# EAGLE design board led (EAGLE 7.6.0)
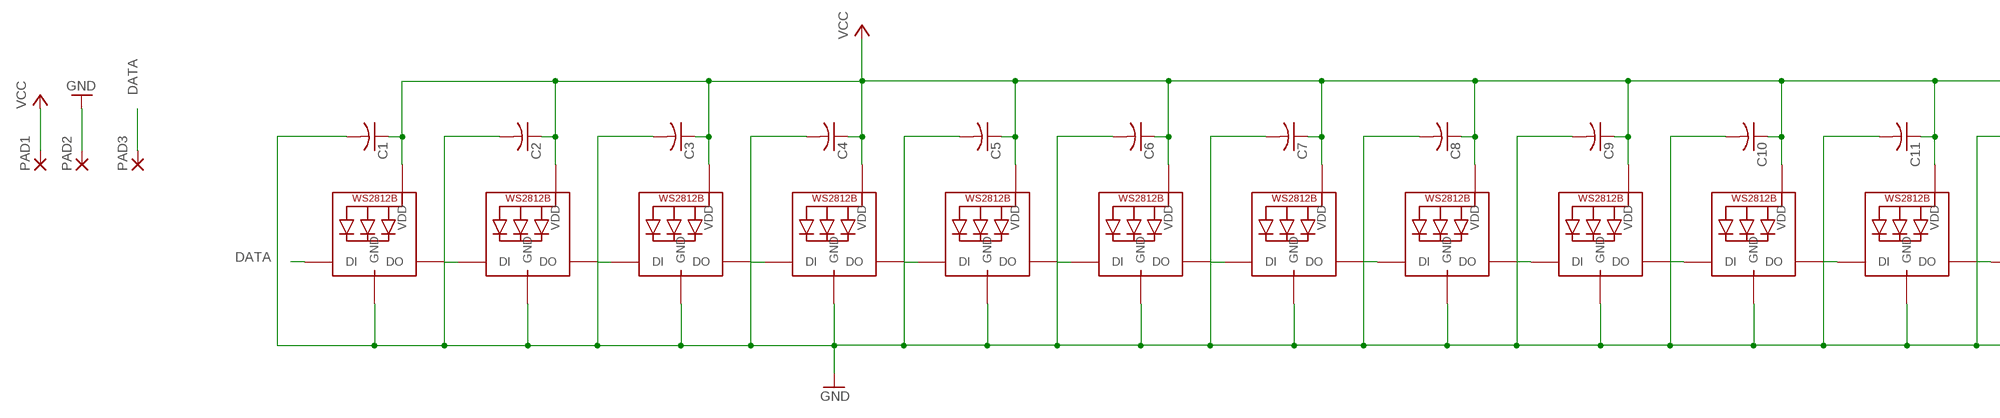
[diagram p0: schematic, sheet 1, part 1 of 2]
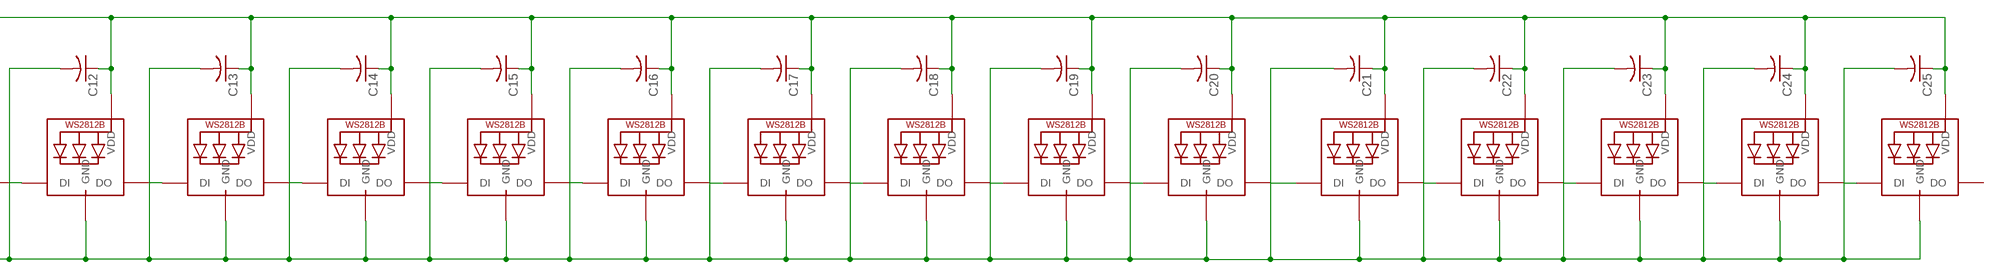
[diagram p1: schematic, sheet 1, part 2 of 2]

## Parts
C1  C-USC0805  [C0805]
C2  C-USC0805  [C0805]
C3  C-USC0805  [C0805]
C4  C-USC0805  [C0805]
C5  C-USC0805  [C0805]
C6  C-USC0805  [C0805]
C7  C-USC0805  [C0805]
C8  C-USC0805  [C0805]
C9  C-USC0805  [C0805]
C10  C-USC0805  [C0805]
C11  C-USC0805  [C0805]
C12  C-USC0805  [C0805]
C13  C-USC0805  [C0805]
C14  C-USC0805  [C0805]
C15  C-USC0805  [C0805]
C16  C-USC0805  [C0805]
C17  C-USC0805  [C0805]
C18  C-USC0805  [C0805]
C19  C-USC0805  [C0805]
C20  C-USC0805  [C0805]
C21  C-USC0805  [C0805]
C22  C-USC0805  [C0805]
C23  C-USC0805  [C0805]
C24  C-USC0805  [C0805]
C25  C-USC0805  [C0805]
LED1  WS2812B5050  [WS2812B]
LED2  WS2812B5050  [WS2812B]
LED3  WS2812B5050  [WS2812B]
LED4  WS2812B5050  [WS2812B]
LED5  WS2812B5050  [WS2812B]
LED6  WS2812B5050  [WS2812B]
LED7  WS2812B5050  [WS2812B]
LED8  WS2812B5050  [WS2812B]
LED9  WS2812B5050  [WS2812B]
LED10  WS2812B5050  [WS2812B]
LED11  WS2812B5050  [WS2812B]
LED12  WS2812B5050  [WS2812B]
LED13  WS2812B5050  [WS2812B]
LED14  WS2812B5050  [WS2812B]
LED15  WS2812B5050  [WS2812B]
LED16  WS2812B5050  [WS2812B]
LED17  WS2812B5050  [WS2812B]
LED18  WS2812B5050  [WS2812B]
LED19  WS2812B5050  [WS2812B]
LED20  WS2812B5050  [WS2812B]
LED21  WS2812B5050  [WS2812B]
LED22  WS2812B5050  [WS2812B]
LED23  WS2812B5050  [WS2812B]
LED24  WS2812B5050  [WS2812B]
LED25  WS2812B5050  [WS2812B]
PAD1  SMD5  [SMD2,54-5,08]
PAD2  SMD5  [SMD2,54-5,08]
PAD3  SMD5  [SMD2,54-5,08]

## Nets
DATA: LED1.4-DIN(DI) PAD3.1(P)
GND: C1.2 C2.2 C3.2 C4.2 C5.2 C6.2 C7.2 C8.2 C9.2 C10.2 C11.2 C12.2 C13.2 C14.2 C15.2 C16.2 C17.2 C18.2 C19.2 C20.2 C21.2 C22.2 C23.2 C24.2 C25.2 LED1.3-GND(GND) LED2.3-GND(GND) LED3.3-GND(GND) LED4.3-GND(GND) LED5.3-GND(GND) LED6.3-GND(GND) LED7.3-GND(GND) LED8.3-GND(GND) LED9.3-GND(GND) LED10.3-GND(GND) LED11.3-GND(GND) LED12.3-GND(GND) LED13.3-GND(GND) LED14.3-GND(GND) LED15.3-GND(GND) LED16.3-GND(GND) LED17.3-GND(GND) LED18.3-GND(GND) LED19.3-GND(GND) LED20.3-GND(GND) LED21.3-GND(GND) LED22.3-GND(GND) LED23.3-GND(GND) LED24.3-GND(GND) LED25.3-GND(GND) PAD2.1(P)
N$1: LED1.2-DOUT(DO) LED2.4-DIN(DI)
N$2: LED2.2-DOUT(DO) LED3.4-DIN(DI)
N$3: LED3.2-DOUT(DO) LED4.4-DIN(DI)
N$4: LED4.2-DOUT(DO) LED5.4-DIN(DI)
N$5: LED5.2-DOUT(DO) LED6.4-DIN(DI)
N$6: LED6.2-DOUT(DO) LED7.4-DIN(DI)
N$7: LED7.2-DOUT(DO) LED8.4-DIN(DI)
N$8: LED8.2-DOUT(DO) LED9.4-DIN(DI)
N$9: LED9.2-DOUT(DO) LED10.4-DIN(DI)
N$10: LED10.2-DOUT(DO) LED11.4-DIN(DI)
N$11: LED11.2-DOUT(DO) LED12.4-DIN(DI)
N$12: LED12.2-DOUT(DO) LED13.4-DIN(DI)
N$13: LED13.2-DOUT(DO) LED14.4-DIN(DI)
N$14: LED14.2-DOUT(DO) LED15.4-DIN(DI)
N$15: LED15.2-DOUT(DO) LED16.4-DIN(DI)
N$16: LED16.2-DOUT(DO) LED17.4-DIN(DI)
N$17: LED17.2-DOUT(DO) LED18.4-DIN(DI)
N$18: LED18.2-DOUT(DO) LED19.4-DIN(DI)
N$19: LED19.2-DOUT(DO) LED20.4-DIN(DI)
N$73: LED21.2-DOUT(DO) LED22.4-DIN(DI)
N$74: LED22.2-DOUT(DO) LED23.4-DIN(DI)
N$75: LED23.2-DOUT(DO) LED24.4-DIN(DI)
N$76: LED24.2-DOUT(DO) LED25.4-DIN(DI)
N$77: LED20.2-DOUT(DO) LED21.4-DIN(DI)
VCC: C1.1 C2.1 C3.1 C4.1 C5.1 C6.1 C7.1 C8.1 C9.1 C10.1 C11.1 C12.1 C13.1 C14.1 C15.1 C16.1 C17.1 C18.1 C19.1 C20.1 C21.1 C22.1 C23.1 C24.1 C25.1 LED1.1-VDD(VDD) LED2.1-VDD(VDD) LED3.1-VDD(VDD) LED4.1-VDD(VDD) LED5.1-VDD(VDD) LED6.1-VDD(VDD) LED7.1-VDD(VDD) LED8.1-VDD(VDD) LED9.1-VDD(VDD) LED10.1-VDD(VDD) LED11.1-VDD(VDD) LED12.1-VDD(VDD) LED13.1-VDD(VDD) LED14.1-VDD(VDD) LED15.1-VDD(VDD) LED16.1-VDD(VDD) LED17.1-VDD(VDD) LED18.1-VDD(VDD) LED19.1-VDD(VDD) LED20.1-VDD(VDD) LED21.1-VDD(VDD) LED22.1-VDD(VDD) LED23.1-VDD(VDD) LED24.1-VDD(VDD) LED25.1-VDD(VDD) PAD1.1(P)
Unconnected: LED25.2-DOUT(DO)

## Library data of the parts
C1-C25 = rcl:C-US: CAPACITOR, American symbol
LED1-LED25 = adafruit:WS2812B
PAD1-PAD3 = wirepad:SMD5: SMD PAD

## Board
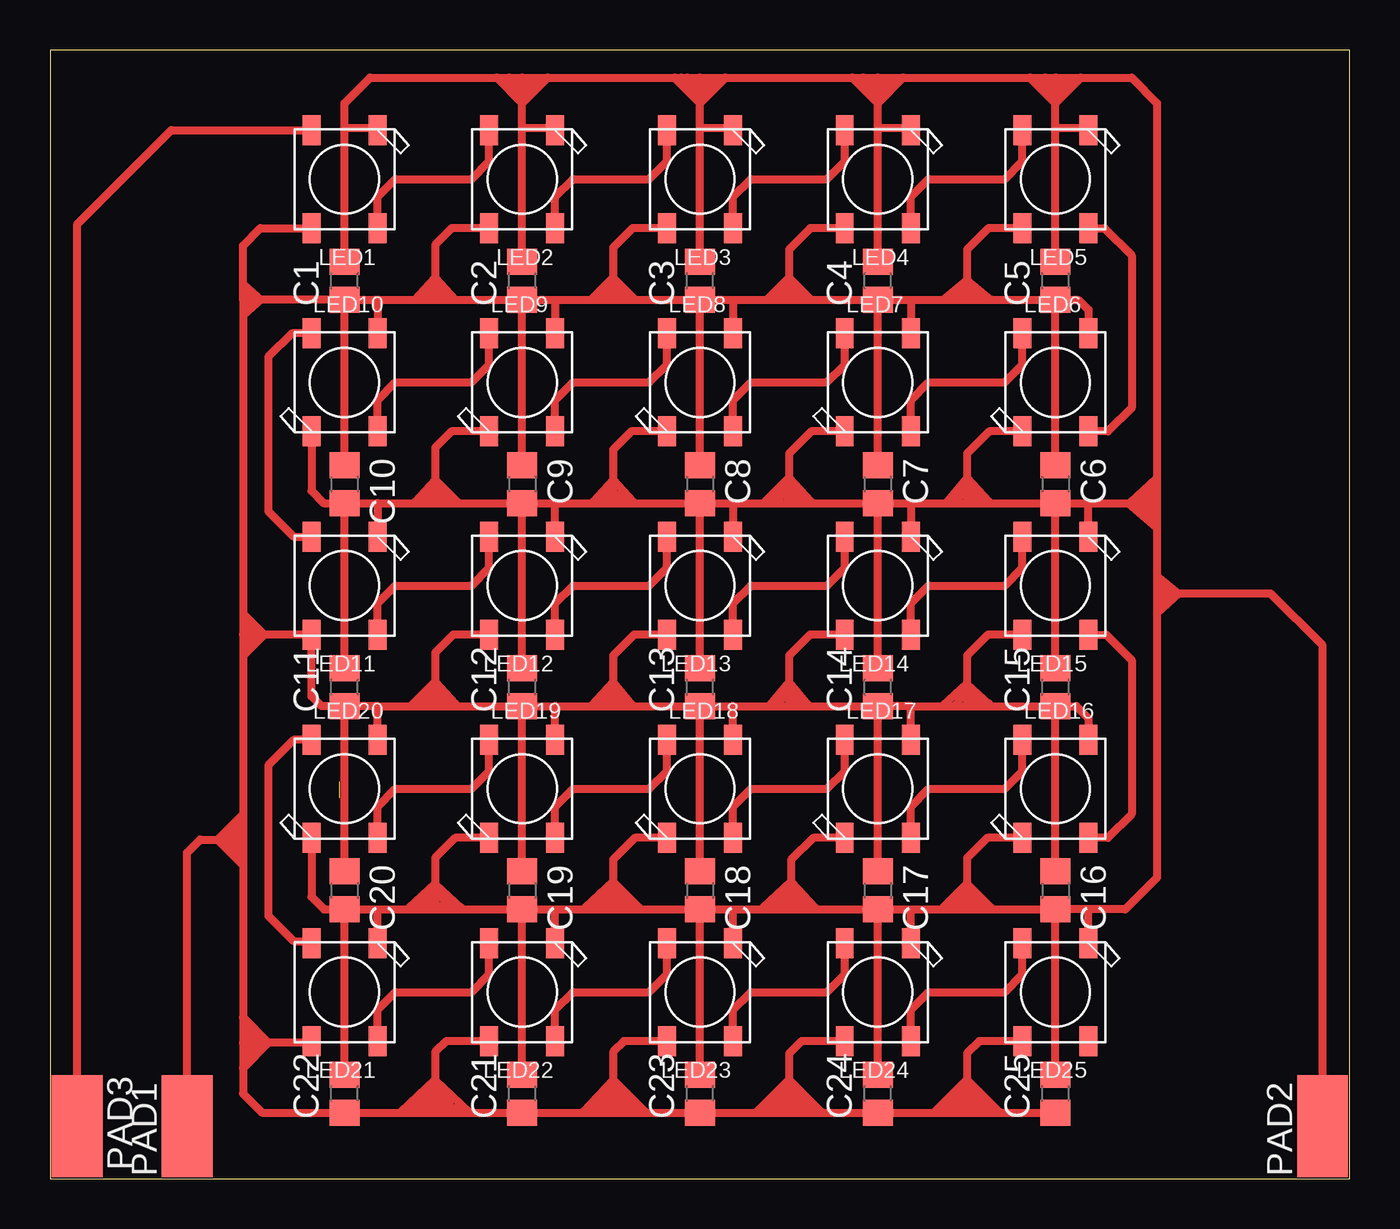
[diagram p2: board, top side]

Size 65 x 56.43 mm. Coordinates in mm from the lower left corner, seen from the top.
Outline: 0,0 65,0 65,56.43 0,56.43 0,0
Copper layers (1*16): Top 0.035mm / dielectric 1.5mm / Bottom 0.035mm
Design rules "default": minimum track width 10mil, minimum drill 24mil, track to track 8mil, track to pad 8mil, pad to pad 8mil, via to via 8mil, smd to smd 8mil, copper to edge 40mil, drill to drill 8mil, minimum pad ring 10mil, minimum via ring 8mil, stop-mask expansion 4mil, vias tented up to drill 0mil, thermal gap 10mil

### Footprints (pad centres in the part's own frame; a part is rotated, then mirrored left to right if it is on the bottom)
C0805 = smd 1.3 x 1.5: 1 -0.95,0; 2 0.95,0
WS2812B = smd 1.5 x 0.9: 1-VDD 2.45,-1.65; 2-DOUT 2.45,1.65; 3-GND -2.45,1.65; 4-DIN -2.45,-1.65
SMD2,54-5,08 = smd 2.54 x 5.08: 1 0,0

### Placement (x,y rotation side)
C1  14.73,44.89 90 top
C2  23.62,44.89 90 top
C3  32.51,44.89 90 top
C4  41.4,44.89 90 top
C5  50.29,44.89 90 top
C6  50.29,34.73 270 top
C7  41.4,34.73 270 top
C8  32.51,34.73 270 top
C9  23.62,34.73 270 top
C10  14.73,34.73 270 top
C11  14.73,24.57 90 top
C12  23.62,24.57 90 top
C13  32.51,24.57 90 top
C14  41.4,24.57 90 top
C15  50.29,24.57 90 top
C16  50.29,14.41 270 top
C17  41.4,14.41 270 top
C18  32.51,14.41 270 top
C19  23.62,14.41 270 top
C20  14.73,14.41 270 top
C21  23.62,4.25 90 top
C22  14.73,4.25 90 top
C23  32.51,4.25 90 top
C24  41.4,4.25 90 top
C25  50.29,4.25 90 top
LED1  14.73,49.97 270 top
LED2  23.62,49.97 270 top
LED3  32.51,49.97 270 top
LED4  41.4,49.97 270 top
LED5  50.29,49.97 270 top
LED6  50.29,39.81 90 top
LED7  41.4,39.81 90 top
LED8  32.51,39.81 90 top
LED9  23.62,39.81 90 top
LED10  14.73,39.81 90 top
LED11  14.73,29.65 270 top
LED12  23.62,29.65 270 top
LED13  32.51,29.65 270 top
LED14  41.4,29.65 270 top
LED15  50.29,29.65 270 top
LED16  50.29,19.49 90 top
LED17  41.4,19.49 90 top
LED18  32.51,19.49 90 top
LED19  23.62,19.49 90 top
LED20  14.73,19.49 90 top
LED21  14.73,9.33 270 top
LED22  23.62,9.33 270 top
LED23  32.51,9.33 270 top
LED24  41.4,9.33 270 top
LED25  50.29,9.33 270 top
PAD1  6.86,2.62 0 top
PAD2  63.65,2.62 0 top
PAD3  1.37,2.62 180 top

### Tracks (layer width: path | path; a pad name or v marks a point on that pad's centre or on a via)
DATA
  Top 0.406: PAD3.1 1.37,47.72 6.07,52.42 LED1.4-DIN
GND
  Top 0.406: C1.2 14.73,52.51 | 14.73,52.51 14.73,53.78 16,55.05 22.35,55.05 | 22.35,55.05 22.97,55.05 | 22.97,55.05 23.62,55.05 | C2.2 23.62,52.51 | 23.62,52.51 23.62,53.78 | 23.62,53.78 23.62,55.05 | C3.2 32.51,52.51 | 32.51,52.51 32.51,53.78 | 32.51,53.78 32.51,55.05 | C4.2 41.4,52.51 | 41.4,52.51 41.4,53.78 | 41.4,53.78 41.4,55.05 | C5.2 50.29,52.51 | 50.29,52.51 50.29,53.78 | 50.29,53.78 50.29,55.05 | LED10.3-GND 13.08,34.38 13.68,33.78 C10.2 | C10.2 16.38,33.78 | 16.38,33.78 LED11.3-GND | C8.2 34.16,33.78 | 34.16,33.78 LED13.3-GND | C7.2 43.05,33.78 | 43.05,33.78 LED14.3-GND | 16.38,33.78 19.27,33.78 | 19.27,33.78 C9.2 | C9.2 25.27,33.78 | 25.27,33.78 28.17,33.78 | 28.17,33.78 C8.2 | LED12.3-GND 25.27,33.78 | 34.16,33.78 36.97,33.78 | 36.97,33.78 C7.2 | 43.05,33.78 45.87,33.78 | 45.87,33.78 C6.2 | C11.2 C10.2 | C12.2 C9.2 | C13.2 C8.2 | C14.2 C7.2 | C15.2 C6.2 | LED20.3-GND 13.08,14.09 13.71,13.46 C20.2 | C17.2 43.05,13.46 | 43.05,13.46 45.87,13.46 | 45.87,13.46 C16.2 | C18.2 34.16,13.46 | 34.16,13.46 37.07,13.46 | 37.07,13.46 C17.2 | C19.2 25.27,13.46 | 25.27,13.46 28.17,13.46 | 28.17,13.46 C18.2 | C20.2 16.38,13.46 | 16.38,13.46 19.27,13.46 | 19.27,13.46 C19.2 | 23.62,55.05 24.89,55.05 | 24.89,55.05 31.24,55.05 | 31.24,55.05 31.57,55.05 | 31.57,55.05 31.87,55.05 | 31.87,55.05 32.51,55.05 | 32.51,55.05 33.78,55.05 | 33.78,55.05 40.13,55.05 | 40.13,55.05 40.67,55.05 | 40.67,55.05 41.4,55.05 | 41.4,55.05 42.67,55.05 | 42.67,55.05 49.02,55.05 | 49.02,55.05 49.77,55.05 | 49.77,55.05 50.29,55.05 | LED1.3-GND 16.38,52.51 14.73,52.51 | LED2.3-GND 25.27,52.51 23.62,52.51 | LED3.3-GND 34.16,52.51 32.51,52.51 | LED4.3-GND 43.05,52.51 41.4,52.51 | LED5.3-GND 51.94,52.51 50.29,52.51 | C6.2 51.94,33.78
  Top 0.406: 51.94,33.78 55.37,33.78 | 55.37,33.78 55.37,33.25 | 55.37,33.25 55.37,32.55 | 55.37,32.55 55.37,30.15 | 55.37,30.15 55.37,29.25 | 55.37,29.25 55.37,28.25 | 55.37,28.25 55.37,15.05 53.78,13.46 51.94,13.46 | 51.94,13.46 C16.2 | LED15.3-GND 51.94,33.78 | 50.29,55.05 51.56,55.05 | 51.56,55.05 54.1,55.05 55.37,53.78 55.37,35.05 | 55.37,35.05 55.37,33.78 | 22.35,55.05 23.62,53.78 | 24.89,55.05 23.62,53.78 | 31.24,55.05 32.51,53.78 | 33.78,55.05 32.51,53.78 | 40.13,55.05 41.4,53.78 | 41.4,53.78 42.67,55.05 | 49.02,55.05 50.29,53.78 | 50.29,53.78 51.56,55.05 | 54.07,33.85 55.37,35.05 | 53.97,33.75 55.37,32.55 | 54.77,33.75 55.37,33.25 | 22.97,55.05 23.57,54.45 | 31.57,55.05 32.37,54.25 | 31.87,55.05 32.47,54.45 | 40.67,55.05 41.37,54.45 | 49.77,55.05 50.17,54.65 | LED9.3-GND 20.07,37.36 19.27,36.55 19.27,34.95 | 19.27,34.95 19.27,33.78 | LED8.3-GND 29.09,37.36 28.17,36.45 28.17,34.95 | 28.17,34.95 28.17,33.78 | LED7.3-GND 38.08,37.36 36.97,36.25 36.97,35.05 | 36.97,35.05 36.97,33.78 | LED6.3-GND 46.98,37.36 45.87,36.25 45.87,35.05 | 45.87,35.05 45.87,33.78 | LED19.3-GND 20.27,17.04 19.27,16.04 19.27,14.75 | 19.27,14.75 19.27,13.46 | LED18.3-GND 29.26,17.04 28.17,15.95 28.17,14.85 | 28.17,14.85 28.17,13.46 | LED17.3-GND 38.18,17.04 37.07,15.93 37.07,14.85 | 37.07,14.85 37.07,13.46 | LED16.3-GND 46.88,17.04 45.87,16.03 45.87,14.75 | 45.87,14.75 45.87,13.46 | 19.27,34.95 18.27,33.85 | 19.27,34.95 20.37,33.85 | 28.17,34.95 27.17,33.85 | 28.17,34.95 29.17,33.85 | 36.97,35.05 35.77,33.85 | 36.97,35.05 38.07,33.85 | 45.87,35.05 44.87,33.85 | 45.87,35.05 46.97,33.85 | 19.27,14.75 17.97,13.55 | 19.27,14.75 20.57,13.55 | 28.17,14.85 26.77,13.55 | 28.17,14.85 29.47,13.55
  Top 0.406: 37.07,14.85 35.67,13.55 | 37.07,14.85 38.27,13.55 | 45.87,14.75 44.67,13.55 | 45.87,14.75 47.07,13.55 | PAD2.1 63.65,26.66 61.06,29.25 56.47,29.25 | 56.47,29.25 55.37,29.25 | 56.47,29.25 55.37,30.15 | 56.47,29.25 55.37,28.25 | C22.2 C20.2 | C21.2 C19.2 | C23.2 C18.2 | C24.2 C17.2 | C25.2 C16.2 | LED21.3-GND 16.38,13.46 | LED22.3-GND 25.27,13.46 | LED23.3-GND 34.16,13.46 | LED24.3-GND 43.05,13.46 | LED25.3-GND 51.94,13.46
N$1
  Top 0.406: LED1.2-DOUT 16.38,49.08 17.27,49.97 21.08,49.97 21.97,50.86 LED2.4-DIN
N$2
  Top 0.406: LED2.2-DOUT 25.27,49.08 26.16,49.97 29.97,49.97 30.86,50.86 LED3.4-DIN
N$3
  Top 0.406: LED3.2-DOUT 34.16,49.08 35.05,49.97 38.86,49.97 39.75,50.86 LED4.4-DIN
N$4
  Top 0.406: LED4.2-DOUT 43.05,49.08 43.94,49.97 47.75,49.97 48.64,50.86 LED5.4-DIN
N$5
  Top 0.406: LED5.2-DOUT 52.74,47.52 54.1,46.16 54.1,38.54 52.92,37.36 LED6.4-DIN
N$6
  Top 0.406: LED7.4-DIN 43.05,38.92 43.94,39.81 47.75,39.81 48.64,40.7 LED6.2-DOUT
N$7
  Top 0.406: LED8.4-DIN 34.16,38.92 35.05,39.81 38.86,39.81 39.75,40.7 LED7.2-DOUT
N$8
  Top 0.406: LED9.4-DIN 25.27,38.92 26.16,39.81 29.97,39.81 30.86,40.7 LED8.2-DOUT
N$9
  Top 0.406: LED10.4-DIN 16.38,38.92 17.27,39.81 21.08,39.81 21.97,40.7 LED9.2-DOUT
N$10
  Top 0.406: LED10.2-DOUT 12.1,42.26 10.92,41.08 10.92,33.37 12.19,32.1 LED11.4-DIN
N$11
  Top 0.406: LED11.2-DOUT 16.38,28.76 17.27,29.65 21.08,29.65 21.97,30.54 LED12.4-DIN
N$12
  Top 0.406: LED12.2-DOUT 25.27,28.76 26.16,29.65 29.97,29.65 30.86,30.54 LED13.4-DIN
N$13
  Top 0.406: LED13.2-DOUT 34.16,28.76 35.05,29.65 38.86,29.65 39.75,30.54 LED14.4-DIN
N$14
  Top 0.406: LED14.2-DOUT 43.05,28.76 43.94,29.65 47.75,29.65 48.64,30.54 LED15.4-DIN
N$15
  Top 0.406: LED15.2-DOUT 52.83,27.2 54.1,25.93 54.1,18.22 52.92,17.04 LED16.4-DIN
N$16
  Top 0.406: LED17.4-DIN 43.05,18.6 43.94,19.49 47.75,19.49 48.64,20.38 LED16.2-DOUT
N$17
  Top 0.406: LED18.4-DIN 34.16,18.6 35.05,19.49 38.86,19.49 39.75,20.38 LED17.2-DOUT
N$18
  Top 0.406: LED19.4-DIN 25.27,18.6 26.16,19.49 29.97,19.49 30.86,20.38 LED18.2-DOUT
N$19
  Top 0.406: LED20.4-DIN 16.38,18.6 17.27,19.49 21.08,19.49 21.97,20.38 LED19.2-DOUT
N$20
  Top 0.406: 54.47,33.65 55.27,32.95
N$21
  Top 0.406: 54.47,33.85 55.27,34.65
N$22
  Top 0.406: 54.87,33.75 55.27,34.15
N$23
  Top 0.406: 23.77,54.25 24.37,54.85
N$24
  Top 0.406: 23.67,54.65 23.97,54.95
N$25
  Top 0.406: 22.67,54.95 23.47,54.15
N$26
  Top 0.406: 32.67,54.15 33.37,54.85
N$27
  Top 0.406: 32.57,54.55 32.97,54.95
N$28
  Top 0.406: 41.47,54.15 42.17,54.85
N$29
  Top 0.406: 41.47,54.55 41.87,54.95
N$30
  Top 0.406: 40.47,54.95 41.27,54.15
N$31
  Top 0.406: 49.47,54.95 50.27,54.15
N$32
  Top 0.406: 50.37,54.15 51.07,54.85
N$33
  Top 0.406: 50.37,54.45 50.87,54.95
N$34
  Top 0.406: 18.57,44.05 19.17,44.65
N$35
  Top 0.406: 18.87,43.95 19.17,44.35
N$36
  Top 0.406: 19.37,44.65 19.97,44.05
N$37
  Top 0.406: 28.27,44.65 28.87,44.05
N$38
  Top 0.406: 28.27,44.35 28.57,44.05
N$39
  Top 0.406: 27.47,43.95 28.07,44.55
N$40
  Top 0.406: 27.87,43.95 28.07,44.25
N$41
  Top 0.406: 36.17,44.05 36.77,44.75
N$42
  Top 0.406: 36.47,43.95 36.87,44.45
N$43
  Top 0.406: 37.07,44.75 37.77,44.05
N$44
  Top 0.406: 45.97,44.65 46.57,44.05
N$45
  Top 0.406: 45.07,44.05 45.77,44.65
N$46
  Top 0.406: 45.37,44.05 45.77,44.35
N$47
  Top 0.406: 9.77,44.35 10.07,44.05 9.97,43.55
N$48
  Top 0.406: 18.57,33.85 19.17,34.45 19.97,33.85 19.07,34.05
N$49
  Top 0.406: 27.57,33.85 28.07,34.35 28.77,34.05 28.37,34.05
N$50
  Top 0.406: 36.27,33.85 36.87,34.45 36.77,34.15 37.67,34.05 37.07,34.45
N$51
  Top 0.406: 45.37,33.85 45.67,34.35 46.57,33.95 46.07,34.35
N$52
  Top 0.406: 18.57,23.75 19.07,24.25 18.97,23.85 19.97,23.85 19.47,24.25
N$53
  Top 0.406: 27.47,23.75 28.07,24.25 27.97,23.85 28.77,23.85 28.37,24.25
N$54
  Top 0.406: 36.37,23.65 36.77,24.15 37.57,23.75 37.27,24.15
N$55
  Top 0.406: 45.27,23.65 45.67,24.15 46.67,23.75 46.07,24.25
N$56
  Top 0.406: 18.37,13.55 19.17,14.25 18.97,13.65 20.27,13.65 19.37,14.15
N$57
  Top 0.406: 27.17,13.55 27.97,14.35 27.77,13.65
N$58
  Top 0.406: 29.17,13.55 28.27,14.25 28.67,13.55
N$59
  Top 0.406: 36.07,13.65 36.87,14.35
N$60
  Top 0.406: 36.97,14.05 36.47,13.55
N$61
  Top 0.406: 37.17,14.45 37.77,13.55
N$62
  Top 0.406: 37.57,13.55 37.27,13.85
N$63
  Top 0.406: 45.07,13.55 45.77,14.25
N$64
  Top 0.406: 45.77,13.95 45.57,13.75
N$65
  Top 0.406: 45.97,14.35 46.67,13.65 45.97,13.85
N$66
  Top 0.406: 10.67,27.25 9.67,28.25
N$67
  Top 0.406: 10.67,27.15 9.67,26.15
N$68
  Top 0.406: 9.87,27.95 9.87,26.55
N$69
  Top 0.406: 10.07,27.75 10.07,26.85
N$70  (1 unrouted)
N$71
  Top 0.406: 55.57,29.85 55.57,28.65
N$72
  Top 0.406: 55.77,29.65 55.77,28.85
N$73
  Top 0.406: LED21.2-DOUT 16.38,8.44 17.27,9.33 21.08,9.33 21.97,10.22 LED22.4-DIN
N$74
  Top 0.406: LED22.2-DOUT 25.27,8.44 26.16,9.33 29.97,9.33 30.86,10.22 LED23.4-DIN
N$75
  Top 0.406: LED23.2-DOUT 34.16,8.44 35.05,9.33 38.86,9.33 39.75,10.22 LED24.4-DIN
N$76
  Top 0.406: LED24.2-DOUT 43.05,8.44 43.94,9.33 47.75,9.33 48.64,10.22 LED25.4-DIN
N$77
  Top 0.406: LED20.2-DOUT 12.19,21.94 10.92,20.67 10.92,13.14 12.19,11.87 13.08,11.87 LED21.4-DIN
N$78
  Top 0.406: 17.97,3.55 20.47,3.55
N$79
  Top 0.406: 18.27,3.95 20.17,3.95
N$80
  Top 0.406: 18.67,4.35 19.87,4.35
N$81
  Top 0.406: 26.97,3.55 29.37,3.55
N$82
  Top 0.406: 27.27,3.85 29.17,3.85
N$83
  Top 0.406: 35.67,3.55 38.17,3.55
N$84
  Top 0.406: 35.97,3.85 37.97,3.85
N$85
  Top 0.406: 36.27,4.15 37.57,4.15
N$86
  Top 0.406: 36.57,4.45 37.37,4.45
N$87
  Top 0.406: 44.57,3.45 47.07,3.45
N$88
  Top 0.406: 44.77,3.75 46.97,3.75
N$89
  Top 0.406: 45.07,4.05 46.67,4.05
N$90
  Top 0.406: 9.87,7.75 9.87,5.85
N$91
  Top 0.406: 10.07,7.45 10.07,6.05
N$92
  Top 0.406: 10.27,7.25 10.27,6.45
N$93
  Top 0.406: 9.47,17.85 9.47,16.15
N$94
  Top 0.406: 9.27,17.75 9.27,16.25
N$95
  Top 0.406: 8.97,17.45 8.97,16.65
VCC
  Top 0.406: C1.1 16.38,43.94 | C2.1 25.27,43.94 | 25.27,43.94 LED9.1-VDD | C3.1 34.16,43.94 | 34.16,43.94 LED8.1-VDD | C4.1 43.05,43.94 | 43.05,43.94 LED7.1-VDD | C5.1 51.44,43.94 51.94,43.44 LED6.1-VDD | C7.1 C4.1 | C10.1 C1.1 | C9.1 C2.1 | C8.1 C3.1 | C6.1 C5.1 | 16.38,43.94 19.27,43.94 | 19.27,43.94 C2.1 | 25.27,43.94 28.17,43.94 | 28.17,43.94 C3.1 | 34.16,43.94 36.97,43.94 | 36.97,43.94 C4.1 | 43.05,43.94 45.87,43.94 | 45.87,43.94 C5.1 | LED20.1-VDD 16.38,23.62 | 16.38,23.62 C11.1 | 16.38,23.62 19.27,23.62 | 19.27,23.62 C12.1 | C12.1 25.27,23.62 | 25.27,23.62 28.17,23.62 | 28.17,23.62 C13.1 | C13.1 34.16,23.62 | 34.16,23.62 36.97,23.62 | 36.97,23.62 C14.1 | LED18.1-VDD 34.16,23.62 | LED17.1-VDD 43.05,23.62 | 43.05,23.62 C14.1 | 43.05,23.62 45.87,23.62 | 45.87,23.62 C15.1 | C15.1 51.34,23.62 51.94,23.02 LED16.1-VDD | C20.1 C11.1 | LED19.1-VDD 25.27,23.62 | C19.1 C12.1 | C18.1 C13.1 | C17.1 C14.1 | C16.1 C15.1 | 9.65,43.95 9.65,46.65 10.52,47.52 LED1.1-VDD | 9.65,43.95 9.65,27.2 | LED2.1-VDD 20.1,47.52 19.27,46.69 19.27,45.05 | 19.27,45.05 19.27,44.45 | 19.27,44.45 19.27,43.94 | LED3.1-VDD 29.14,47.52 28.17,46.55 28.17,45.05 | 28.17,45.05 28.17,43.94 | LED4.1-VDD 38.03,47.52 36.97,46.46 36.97,45.05 | 36.97,45.05 36.97,44.55 | 36.97,44.55 36.97,43.94 | LED5.1-VDD 46.94,47.52 45.87,46.45 45.87,44.95 | 45.87,44.95 45.87,44.35 | 45.87,44.35 45.87,43.94 | 18.27,43.95 19.27,45.05 | 19.27,45.05 20.27,43.95 | 27.07,43.95 28.17,45.05 | 28.17,45.05 29.27,43.95 | 35.87,43.95 36.97,45.05 | 36.97,45.05 38.07,43.95 | 44.67,43.95 45.87,44.95 | 45.87,44.95 47.07,43.95 | 19.27,44.45 19.67,44.05 | 36.97,44.55 37.47,44.05 | 45.87,44.35 46.27,44.15 | C1.1 10.57,43.95 | 10.57,43.95 9.65,43.95 | 16.38,43.94 LED10.1-VDD
  Top 0.406: 9.67,44.75 10.57,43.95 | 10.57,43.95 9.67,43.15 | LED12.1-VDD 20.17,27.2 19.27,26.3 19.27,24.85 | 19.27,24.85 19.27,23.62 | LED13.1-VDD 29.22,27.2 28.17,26.15 28.17,24.85 | 28.17,24.85 28.17,23.62 | LED14.1-VDD 38.02,27.2 36.97,26.14 36.97,24.85 | 36.97,24.85 36.97,23.62 | LED15.1-VDD 46.92,27.2 45.87,26.14 45.87,24.75 | 45.87,24.75 45.87,23.62 | 19.27,24.85 18.07,23.65 | 19.27,24.85 20.27,23.75 | 28.17,24.85 27.07,23.65 | 28.17,24.85 29.17,23.65 | 36.97,24.85 35.97,23.65 | 36.97,24.85 37.97,23.65 | 45.87,24.75 44.67,23.65 | 45.87,24.75 46.97,23.75 | 9.65,27.2 LED11.1-VDD 13.08,24.12 13.58,23.62 C11.1 | 19.27,3.3 C22.1 10.6,3.3 9.65,4.25 9.65,5.52 | 19.27,3.3 C21.1 28.17,3.3 | 28.17,3.3 C23.1 36.97,3.3 | 36.97,3.3 C24.1 45.87,3.3 | 45.87,3.3 C25.1 | LED22.1-VDD 19.82,6.88 19.27,6.33 19.27,4.95 | 19.27,4.95 19.27,3.3 | LED23.1-VDD 28.71,6.88 28.17,6.34 28.17,4.95 | 28.17,4.95 28.17,3.3 | LED24.1-VDD 37.6,6.88 36.97,6.25 36.97,4.95 | 36.97,4.95 36.97,3.3 | LED25.1-VDD 46.49,6.88 45.87,6.26 45.87,4.95 | 45.87,4.95 45.87,3.3 | 19.27,4.95 17.57,3.35 | 19.27,4.95 20.97,3.35 | 28.17,4.95 26.67,3.35 | 28.17,4.95 28.87,4.25 | 28.87,4.25 29.77,3.35 | 27.57,4.25 28.87,4.25 | 36.97,4.95 35.37,3.35 | 36.97,4.95 38.57,3.35 | 45.87,4.95 45.27,4.35 | 45.27,4.35 44.27,3.35 | 45.87,4.95 46.47,4.35 | 46.47,4.35 47.47,3.35 | 45.27,4.35 46.47,4.35 | 9.65,27.2 9.65,18.22 | 9.65,18.22 9.65,16.95 | 9.65,16.95 9.65,15.68 | 9.65,15.68 9.65,8.06 | 9.65,8.06 9.65,6.79 | 9.65,6.79 9.65,5.52 | LED21.1-VDD 13.08,6.79 10.92,6.79 | 10.92,6.79 9.65,6.79 | 10.92,6.79 9.65,8.06 | 10.92,6.79 9.65,5.52 | PAD1.1 6.86,16.3 7.51,16.95 8.38,16.95 | 8.38,16.95 9.65,16.95 | 8.38,16.95 9.65,18.22
  Top 0.406: 8.38,16.95 9.65,15.68